# Altium schematic sheet 4_XDS110.SchDoc (part 1 of 2)
size 420 x 297 mm
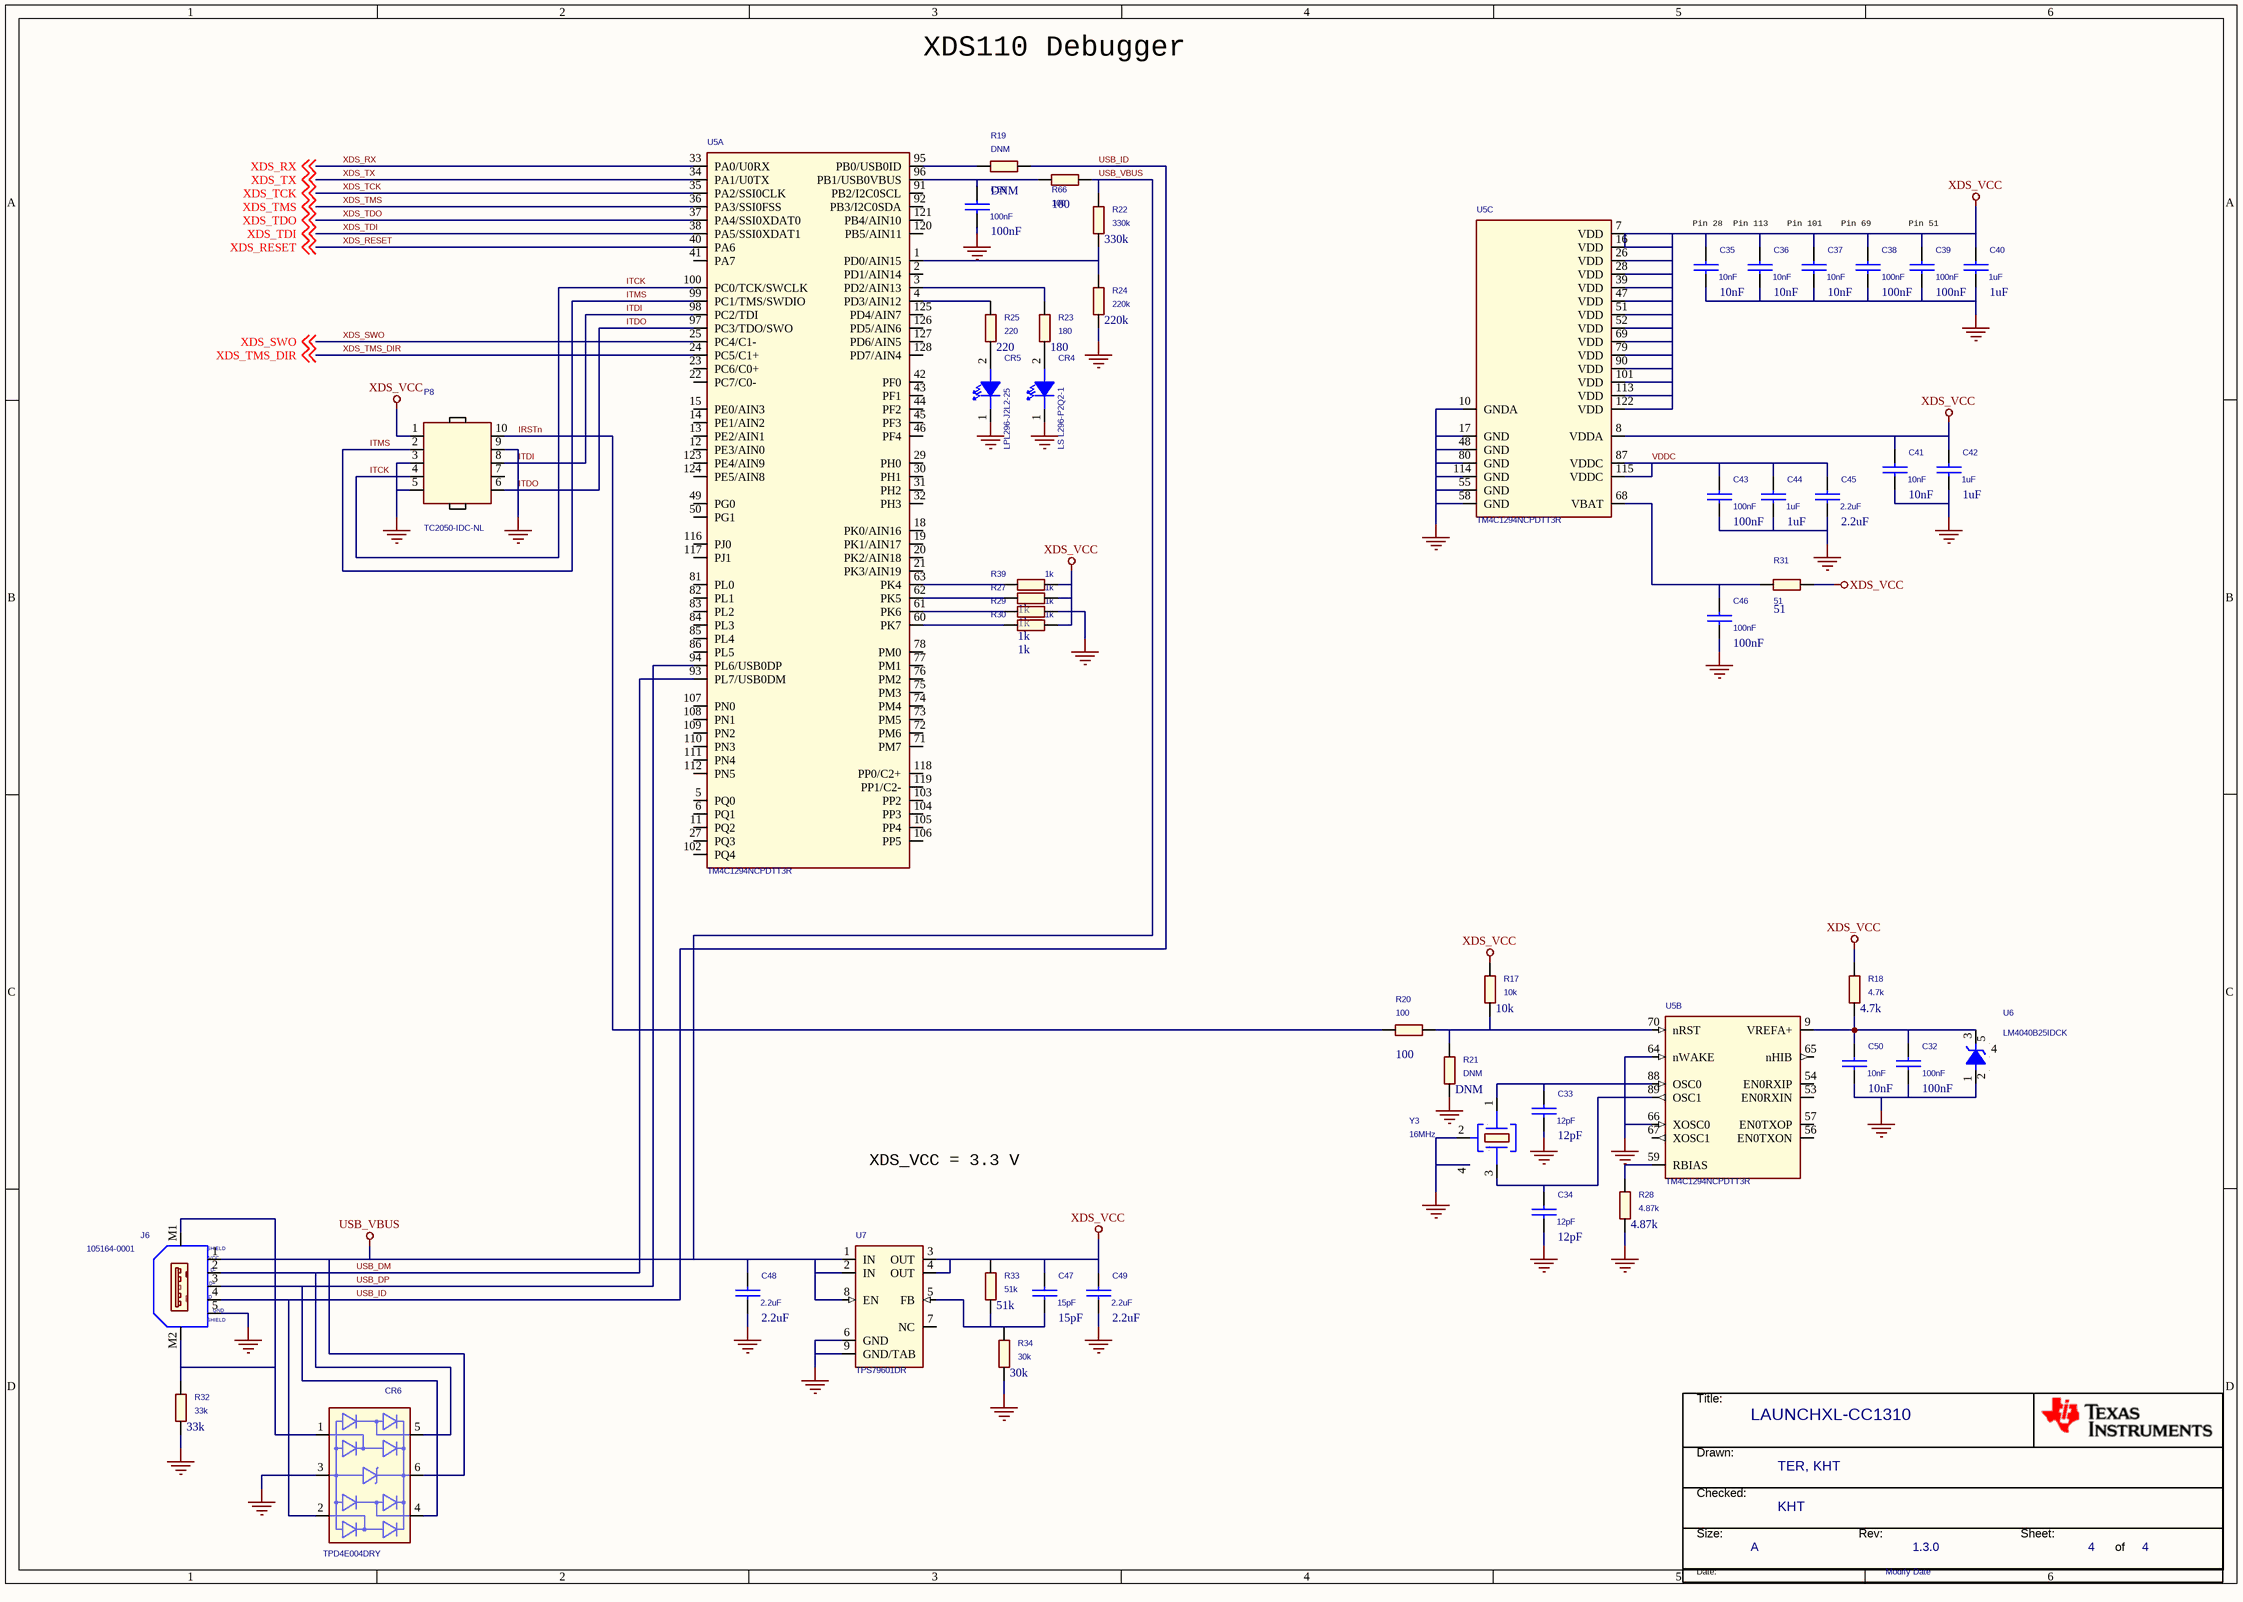
[diagram p0: 4_XDS110.SchDoc]

## Parts
*  Designer name: KHT  Check name: TER, KHT  Design Modify Date: Modify Date  Page Size: A  RevCode: 1.3.0  Page Count: 4  Title: LAUNCHXL-CC1310  (hidden comment: TI_Norway_Title_Block_BMP)  (graphical)
C32  100nF  [CAPC1005X60B2N]
C33  12pF  [CAPC1005X60B2N]
C34  12pF  [CAPC1005X60B2N]
C35  10nF  [CAPC1005X60B2N]
C36  10nF  [CAPC1005X60B2N]
C37  10nF  [CAPC1005X60B2N]
C38  100nF  [CAPC1005X60B2N]
C39  100nF  [CAPC1005X60B2N]
C40  1uF  [CAPC1005X60B2N]
C41  10nF  [CAPC1005X60B2N]
C42  1uF  [CAPC1005X60B2N]
C43  100nF  [CAPC1005X60B2N]
C44  1uF  [CAPC1005X60B2N]
C45  2.2uF  [CAPC1005X60B2N]
C46  100nF  [CAPC1005X60B2N]
C47  15pF  [CAPC1005X60B2N]
C48  2.2uF  [CAPC1005X60B2N]
C49  2.2uF  [CAPC1005X60B2N]
C50  10nF  [CAPC1005X60B2N]
C59  100nF  [CAPC1005X60B2N]
CR4  LS L296-P2Q2-1  [LEDC1708X67L]
CR5  LPL296-J2L2-25  [LEDC1707X65L]
CR6  TPD4E004DRY  [SON50P100X145X60-6N]
J6  105164-0001  [MOLEX_1051640001_A2N]
P8  TC2050-IDC-NL  [TAGCONNECT_TC2050IDCNLN]
R17  10k  [RESC1005X40B2N]
R18  4.7k  [RESC1005X40B2N]
R19  DNM  [RESC1005X40B2N]
R20  100  [RESC1005X40B2N]
R21  DNM  [RESC1005X40B2N]
R22  330k  [RESC1005X40B2N]
R23  180  [RESC1005X40B2N]
R24  220k  [RESC1005X40B2N]
R25  220  [RESC1005X40B2N]
R27  1k  [RESC1005X40B2N]
R28  4.87k  [RESC1005X40B2N]
R29  1k  [RESC1005X40B2N]
R30  1k  [RESC1005X40B2N]
R31  51  [RESC1005X40B2N]
R32  33k  [RESC1005X40B2N]
R33  51k  [RESC1005X40B2N]
R34  30k  [RESC1005X40B2N]
R39  1k  [RESC1005X40B2N]
R66  100  [RESC1005X40B2N]
U5  TM4C1294NCPDTT3R  [QFP40P1600X1600X120-128N]  (parts A,B,C of 3)
U6  LM4040B25IDCK  [SOT65P210X110-5N]
U7  TPS79601DR  [SON65P300X300X100-9AL]
Y3  16MHz  [OSCCC250X320X100-4BN]

## Nets
ITDI: C32.2 C33.2 C34.2 C35.2 C36.2 C37.2 C38.2 C39.2 C40.2 C41.2 C42.2 C43.2 C44.2 C45.2 C46.2 C48.2 C49.2 C50.2 C59.2 CR4.1(C) CR5.1(C) CR6.3 J6.5(GND) P8.3 P8.5 P8.6 P8.8 P8.9 R21.2 R24.2 R28.1 R29.2 R32.1 R34.1 U5.10(GNDA) U5.17(GND) U5.48(GND) U5.55(GND) U5.58(GND) U5.64(nWAKE) U5.66(XOSC0) U5.80(GND) U5.97(PC3/TDO/SWO) U5.98(PC2/TDI) U5.114(GND) U6.1(ANODE) U7.6(GND) U7.9(GND/TAB) Y3.2(GND) Y3.4(NC_4)  [also labelled GND, ITDO]
USB_VBUS: C48.1 CR6.6 J6.1(VCC) R22.2 R66.1 U7.1(IN) U7.2(IN) U7.8(EN)
XDS_VCC: C35.1 C36.1 C37.1 C38.1 C39.1 C40.1 C41.1 C42.1 C47.1 C49.1 P8.1 R17.2 R18.2 R27.1 R30.2 R31.2 R33.2 R39.1 U5.7(VDD) U5.8(VDDA) U5.16(VDD) U5.26(VDD) U5.28(VDD) U5.39(VDD) U5.47(VDD) U5.51(VDD) U5.52(VDD) U5.69(VDD) U5.79(VDD) U5.90(VDD) U5.101(VDD) U5.113(VDD) U5.122(VDD) U7.3(OUT) U7.4(OUT)
IRSTn: P8.10 R20.2
ITCK: P8.4 U5.100(PC0/TCK/SWCLK)
ITMS: P8.2 U5.99(PC1/TMS/SWDIO)
USB_DM: CR6.5 J6.2(D-) U5.93(PL7/USB0DM)
USB_DP: CR6.4 J6.3(D+) U5.94(PL6/USB0DP)
USB_ID: CR6.2 J6.4(ID) R19.1
VDDC: C43.1 C44.1 C45.1 U5.87(VDDC) U5.115(VDDC)
XDS_RESET: U5.40(PA6) ; off-sheet XDS_RESET
XDS_RX: U5.33(PA0/U0RX) ; off-sheet XDS_RX
XDS_SWO: U5.25(PC4/C1-) ; off-sheet XDS_SWO
XDS_TCK: U5.35(PA2/SSI0CLK) ; off-sheet XDS_TCK
XDS_TDI: U5.38(PA5/SSI0XDAT1) ; off-sheet XDS_TDI
XDS_TDO: U5.37(PA4/SSI0XDAT0) ; off-sheet XDS_TDO
XDS_TMS: U5.36(PA3/SSI0FSS) ; off-sheet XDS_TMS
XDS_TMS_DIR: U5.24(PC5/C1+) ; off-sheet XDS_TMS_DIR
XDS_TX: U5.34(PA1/U0TX) ; off-sheet XDS_TX
NetC32_1: C32.1 C50.1 R18.1 U5.9(VREFA+) U6.3(CATHODE)
NetC33_1: C33.1 U5.88(OSC0) Y3.1
NetC34_1: C34.1 U5.89(OSC1) Y3.3
NetC46_1: C46.1 R31.1 U5.68(VBAT)
NetC47_2: C47.2 R33.1 R34.2 U7.5(FB)
NetC59_1: C59.1 R66.2 U5.96(PB1/USB0VBUS)
NetCR4_2: CR4.2(A) R23.1
NetCR5_2: CR5.2(A) R25.1
NetCR6_1: CR6.1 J6.M1(SHIELD1) J6.M2(SHIELD2) R32.2
NetR17_1: R17.1 R20.1 R21.1 U5.70(nRST)
NetR19_2: R19.2 U5.95(PB0/USB0ID)
NetR22_1: R22.1 R24.1 U5.1(PD0/AIN15)
NetR23_2: R23.2 U5.3(PD2/AIN13)
NetR25_2: R25.2 U5.4(PD3/AIN12)
NetR27_2: R27.2 U5.62(PK5)
NetR28_2: R28.2 U5.59(RBIAS)
NetR29_1: R29.1 U5.61(PK6)
NetR30_1: R30.1 U5.60(PK7)
NetR39_2: R39.2 U5.63(PK4)

Not connected (* = marked no-connect by the designer): P8 7(9); U5 2(PD1/AIN14) 5(PQ0) 6(PQ1) 11(PQ2) 12(PE3/AIN0) 13(PE2/AIN1) 14(PE1/AIN2) 15(PE0/AIN3) 18(PK0/AIN16) 19(PK1/AIN17) 20(PK2/AIN18) 21(PK3/AIN19) 22(PC7/C0-) 23(PC6/C0+) 27(PQ3) 29(PH0) 30(PH1) 31(PH2) 32(PH3) 41(PA7) 42(PF0) 43(PF1) 44(PF2) 45(PF3) 46(PF4) 49(PG0) 50(PG1) 53(EN0RXIN) 54(EN0RXIP) 56(EN0TXON) 57(EN0TXOP) 65(nHIB) 67(XOSC1) 71(PM7) 72(PM6) 73(PM5) 74(PM4) 75(PM3) 76(PM2) 77(PM1) 78(PM0) 81(PL0) 82(PL1) 83(PL2) 84(PL3) 85(PL4) 86(PL5) 91(PB2/I2C0SCL) 92(PB3/I2C0SDA) 102(PQ4) 103(PP2) 104(PP3) 105(PP4) 106(PP5) 107(PN0) 108(PN1) 109(PN2) 110(PN3) 111(PN4) 112(PN5) 116(PJ0) 117(PJ1) 118(PP0/C2+) 119(PP1/C2-) 120(PB5/AIN11) 121(PB4/AIN10) 123(PE4/AIN9) 124(PE5/AIN8) 125(PD4/AIN7) 126(PD5/AIN6) 127(PD6/AIN5) 128(PD7/AIN4); U6 2(NC_2) 4(NC_4) 5(NC_5); U7 7(NC)

## Notes on the sheet
- XDS110 Debugger
- (near C35) Pin 28
- Pin 113
- Pin 101
- Pin 69
- (near C39) Pin 51
- XDS_VCC = 3.3 V
- (in symbol CONN_USB_MICRO_B_2MH) SHIELD
- (in symbol TI_Norway_Title_Block_BMP) Title:; Drawn:; Checked:; Size:; Rev:; Sheet:; of; Date: